# EAGLE design Adafruit PiTFT+ 2.8in (EAGLE 6.6.0)
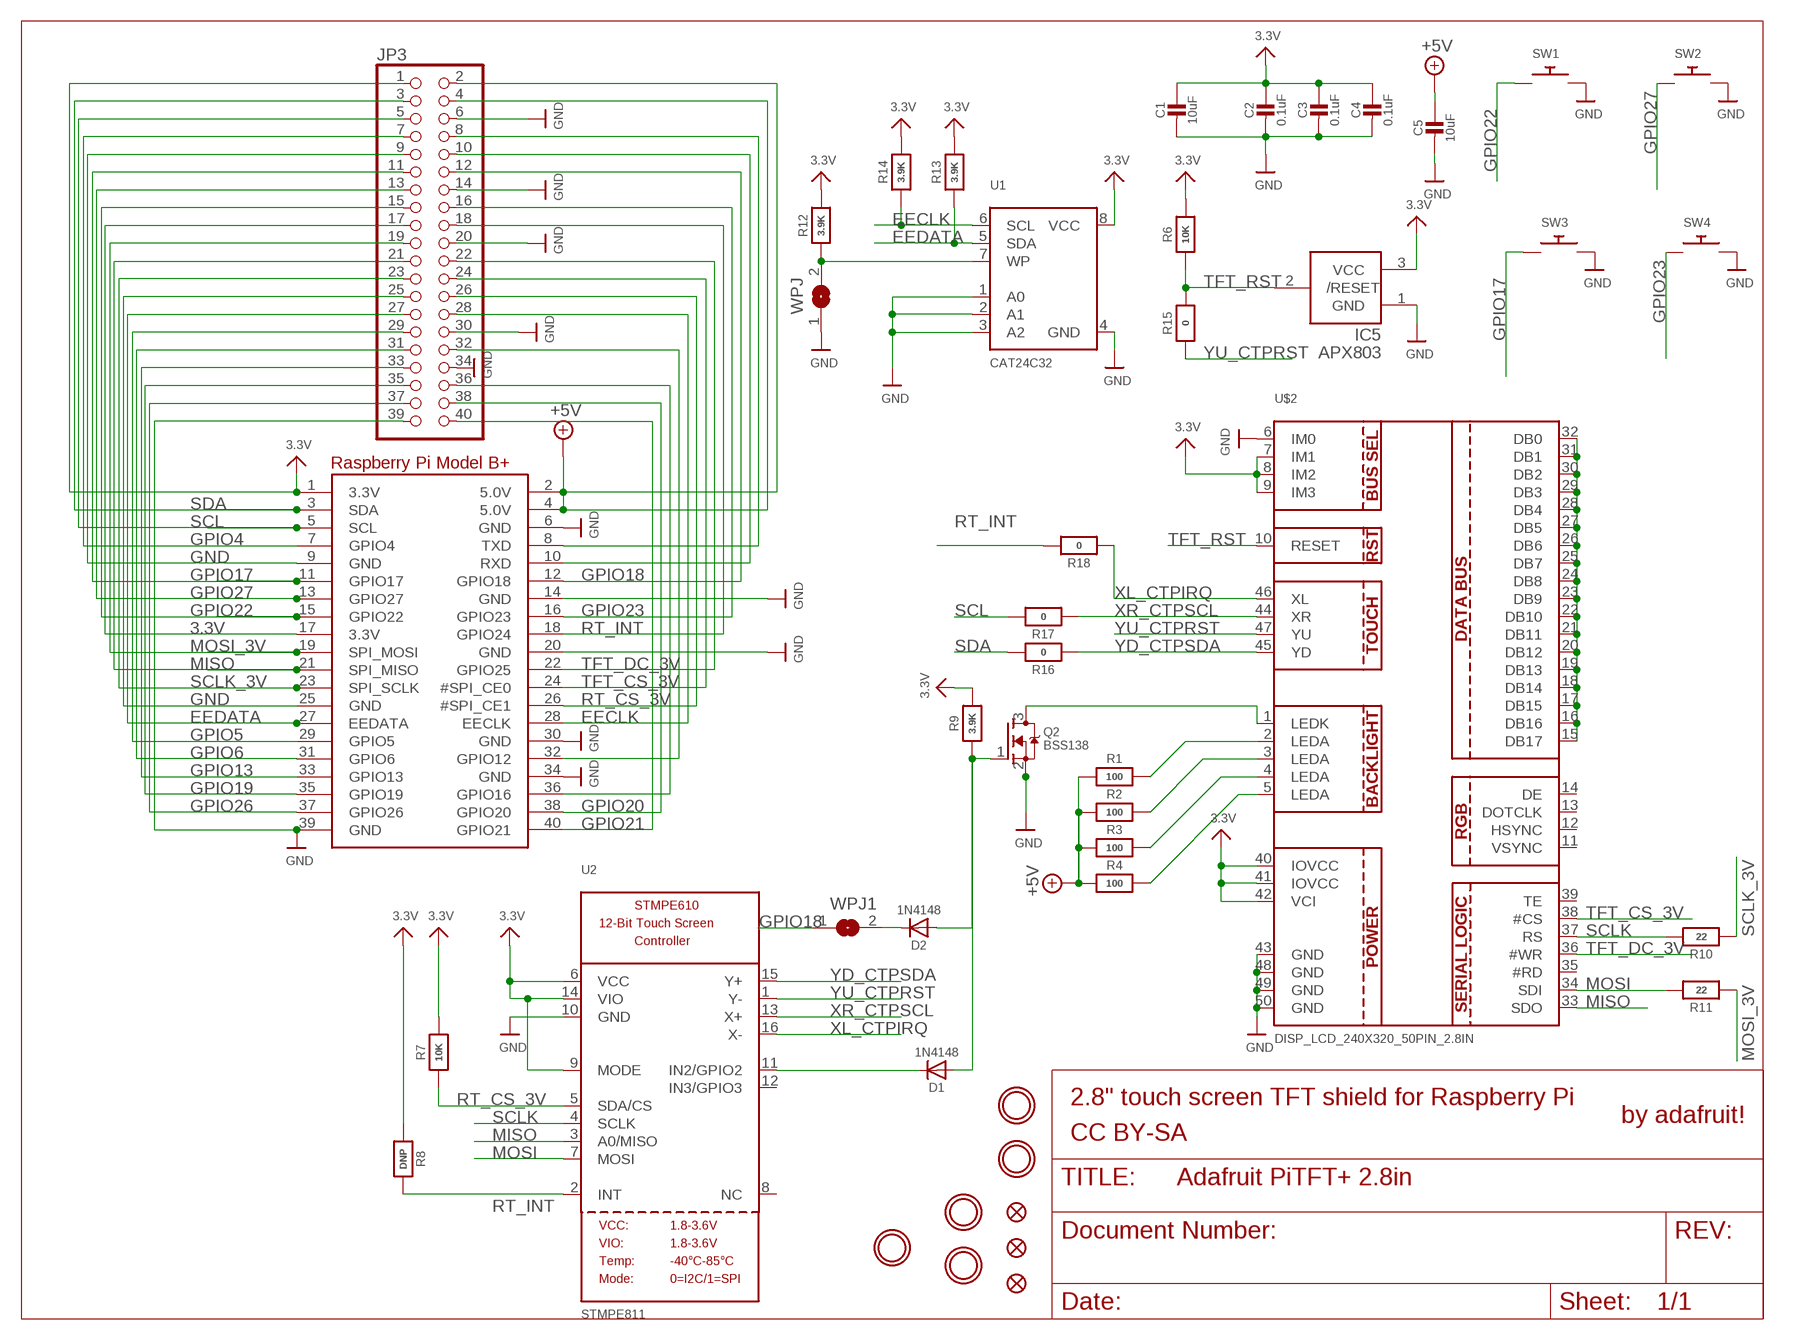
[diagram p0: schematic, sheet 1]

## Parts
C1  10uF  CAP_CERAMIC0805-NOOUTLINE  [0805-NO]
C2  0.1uF  CAP_CERAMIC0805-NOOUTLINE  [0805-NO]
C3  0.1uF  CAP_CERAMIC0805-NOOUTLINE  [0805-NO]
C4  0.1uF  CAP_CERAMIC0805-NOOUTLINE  [0805-NO]
C5  10uF  CAP_CERAMIC0805-NOOUTLINE  [0805-NO]
D1  1N4148  DIODESOD-323  [SOD-323]
D2  1N4148  DIODESOD-323  [SOD-323]
IC5  APX803  AXP083-SAG  [SOT23]
JP3  PINHD-2X20_SMT  [2X20_SMT_MALE]
Q2  BSS138  MOSFET-NWIDE  [SOT23-WIDE]
R1  100  RESISTOR0805_NOOUTLINE  [0805-NO]
R2  100  RESISTOR0805_NOOUTLINE  [0805-NO]
R3  100  RESISTOR0805_NOOUTLINE  [0805-NO]
R4  100  RESISTOR0805_NOOUTLINE  [0805-NO]
R6  10K  RESISTOR0805_NOOUTLINE  [0805-NO]
R7  10K  RESISTOR0805_NOOUTLINE  [0805-NO]
R8  DNP  RESISTOR0805_NOOUTLINE  [0805-NO]
R9  3.9K  RESISTOR0805_NOOUTLINE  [0805-NO]
R10  22  RESISTOR0805_NOOUTLINE  [0805-NO]
R11  22  RESISTOR0805_NOOUTLINE  [0805-NO]
R12  3.9K  RESISTOR0805_NOOUTLINE  [0805-NO]
R13  3.9K  RESISTOR0805_NOOUTLINE  [0805-NO]
R14  3.9K  RESISTOR0805_NOOUTLINE  [0805-NO]
R15  0  RESISTOR0805_NOOUTLINE  [0805-NO]
R16  0  RESISTOR0805_NOOUTLINE  [0805-NO]
R17  0  RESISTOR0805_NOOUTLINE  [0805-NO]
R18  0  RESISTOR0805_NOOUTLINE  [0805-NO]
RPI1  RASPBERRYPI_BPLUS_SHIELD_NODIM  [RASPBERRYPI_BPLUS_SHIELD_NODIM]
SW1  SWITCH_PUSHBUTTONEVQ-PE  [TACT_PANA-EVQ]
SW2  SWITCH_PUSHBUTTONEVQ-PE  [TACT_PANA-EVQ]
SW3  SWITCH_PUSHBUTTONEVQ-PE  [TACT_PANA-EVQ]
SW4  SWITCH_PUSHBUTTONEVQ-PE  [TACT_PANA-EVQ]
U1  CAT24C32  EEPROM_I2C_SOIC8_GENERIC  [SOIC8_150MIL]
U2  STMPE811  STMPE610  [QFN16_3MM]
U$2  DISP_LCD_240X320_50PIN_2.8IN  [TFT_2.83IN_240X320_50PIN]
U$3  MOUNTINGHOLE3.0THIN  [MOUNTINGHOLE_3.0_PLATEDTHIN]
U$10  FIDUCIAL""  [FIDUCIAL_1MM]
U$11  FIDUCIAL""  [FIDUCIAL_1MM]
U$15  MOUNTINGHOLE3.0THIN  [MOUNTINGHOLE_3.0_PLATEDTHIN]
U$16  MOUNTINGHOLE3.0THIN  [MOUNTINGHOLE_3.0_PLATEDTHIN]
U$17  MOUNTINGHOLE3.0THIN  [MOUNTINGHOLE_3.0_PLATEDTHIN]
U$18  FIDUCIAL""  [FIDUCIAL_1MM]
U$40  MOUNTINGHOLE3.0THIN  [MOUNTINGHOLE_3.0_PLATEDTHIN]
WPJ  SOLDERJUMPERCLOSED  [SOLDERJUMPER_CLOSEDWIRE]
WPJ1  SOLDERJUMPERCLOSED  [SOLDERJUMPER_CLOSEDWIRE]

## Nets
3.3V: C1.1 C2.1 C3.1 C4.1 IC5.3(VCC) JP3.1 JP3.17 R6.2 R7.2 R8.1 R9.2 R12.2 R13.2 R14.2 RPI1.1(3.3V) RPI1.17(3.3V) U1.8(VCC) U2.6(VCC) U2.9(MODE) U2.14(VIO) U$2.7(IM1) U$2.8(IM2) U$2.9(IM3) U$2.40(IOVCC) U$2.41(IOVCC) U$2.42(VCI)
+5V: C5.1 JP3.2 JP3.4 R1.1 R2.1 R3.1 R4.1 RPI1.2(5.0V) RPI1.4(5.0V)
EECLK: JP3.28 R14.1 RPI1.28(EECLK) U1.6(SCL)
EEDATA: JP3.27 R13.1 RPI1.27(EEDATA) U1.5(SDA)
GND: C1.2 C2.2 C3.2 C4.2 C5.2 IC5.1(GND) JP3.6 JP3.9 JP3.14 JP3.20 JP3.25 JP3.30 JP3.34 JP3.39 Q2.2(S) RPI1.6(GND) RPI1.9(GND) RPI1.14(GND) RPI1.20(GND) RPI1.25(GND) RPI1.30(GND) RPI1.34(GND) RPI1.39(GND) SW1.P$2 SW2.P$2 SW3.P$2 SW4.P$2 U1.1(A0) U1.2(A1) U1.3(A2) U1.4(GND) U2.10(GND) U$2.6(IM0) U$2.43(GND) U$2.48(GND) U$2.49(GND) U$2.50(GND) WPJ.1
GPIO4: JP3.7 RPI1.7(GPIO4)
GPIO5: JP3.29 RPI1.29(GPIO5)
GPIO6: JP3.31 RPI1.31(GPIO6)
GPIO12: JP3.32 RPI1.32(GPIO12)
GPIO13: JP3.33 RPI1.33(GPIO13)
GPIO16: JP3.36 RPI1.36(GPIO16)
GPIO17: JP3.11 RPI1.11(GPIO17) SW3.P$1
GPIO18: JP3.12 RPI1.12(GPIO18) WPJ1.1
GPIO19: JP3.35 RPI1.35(GPIO19)
GPIO20: JP3.38 RPI1.38(GPIO20)
GPIO21: JP3.40 RPI1.40(GPIO21)
GPIO22: JP3.15 RPI1.15(GPIO22) SW1.P$1
GPIO23: JP3.16 RPI1.16(GPIO23) SW4.P$1
GPIO26: JP3.37 RPI1.37(GPIO26)
GPIO27: JP3.13 RPI1.13(GPIO27) SW2.P$1
MISO: JP3.21 RPI1.21(SPI_MISO) U2.3(A0/MISO) U$2.33(SDO)
MOSI: R11.2 U2.7(MOSI) U$2.34(SDI)
MOSI_3V: JP3.19 R11.1 RPI1.19(SPI_MOSI)
N$1: Q2.3(D) U$2.1(LEDK)
N$2: R1.2 U$2.2(LEDA)
N$3: R2.2 U$2.3(LEDA)
N$4: R3.2 U$2.4(LEDA)
N$5: D1.C U2.11(IN2/GPIO2)
N$6: D2.C WPJ1.2
N$9: U$2.15(DB17) U$2.16(DB16) U$2.17(DB15) U$2.18(DB14) U$2.19(DB13) U$2.20(DB12) U$2.21(DB11) U$2.22(DB10) U$2.23(DB9) U$2.24(DB8) U$2.25(DB7) U$2.26(DB6) U$2.27(DB5) U$2.28(DB4) U$2.29(DB3) U$2.30(DB2) U$2.31(DB1) U$2.32(DB0)
N$10: R4.2 U$2.5(LEDA)
N$12: R12.1 U1.7(WP) WPJ.2
N$16: D1.A D2.A Q2.1(G) R9.1
RT_CS_3V: JP3.26 R7.1 RPI1.26(#SPI_CE1) U2.5(SDA/CS)
RT_INT: JP3.18 R8.2 R18.2 RPI1.18(GPIO24) U2.2(INT)
RXD: JP3.10 RPI1.10(RXD)
SCL: JP3.5 R17.2 RPI1.5(SCL)
SCLK: R10.2 U2.4(SCLK) U$2.37(RS)
SCLK_3V: JP3.23 R10.1 RPI1.23(SPI_SCLK)
SDA: JP3.3 R16.2 RPI1.3(SDA)
TFT_CS_3V: JP3.24 RPI1.24(#SPI_CE0) U$2.38(#CS)
TFT_DC_3V: JP3.22 RPI1.22(GPIO25) U$2.36(#WR)
TFT_RST: IC5.2(/RESET) R6.1 R15.2 U$2.10(RESET)
TXD: JP3.8 RPI1.8(TXD)
XL_CTPIRQ: R18.1 U2.16(X-) U$2.46(XL)
XR_CTPSCL: R17.1 U2.13(X+) U$2.44(XR)
YD_CTPSDA: R16.1 U2.15(Y+) U$2.45(YD)
YU_CTPRST: R15.1 U2.1(Y-) U$2.47(YU)
Unconnected: U2.8(NC) U2.12(IN3/GPIO3) U$2.11(VSYNC) U$2.12(HSYNC) U$2.13(DOTCLK) U$2.14(DE) U$2.35(#RD) U$2.39(TE)

## Notes on the sheet
- 2.8" touch screen TFT shield for Raspberry Pi
- by adafruit!
- CC BY-SA

## Library data of the parts
C1-C5 = microbuilder:CAP_CERAMIC: Ceramic Capacitors For new designs, use the packages preceded by an '_' character since they are more reliable: The following footprints should be used on most boards: _0402 - Standard footprint for regular board layouts _0603 - Standard footprint for regular board layouts _0805 - Standard footprint for regular board layouts _1206 - Standard footprint for regular board layouts For extremely tight-pitch boards where space is at a premium, the following 'micro-pitch' footprints can be used (smaller pads, no silkscreen outline, etc.): _0402MP - Micro-pitch footprint for very dense/compact boards _0603MP - Micro-pitch footprint for very dense/compact boards _0805MP - Micro-pitch footprint for very dense/compact boards _1206MP - Micro-pitch footprint for very dense/compact boards
D1 D2 = microbuilder:DIODE: Diode SMA Model Volts Amps Type Vf Ir Digikey # Notes SSA34-E3 40V 3A Schottky 480mV @ 3A 200uA @ 40V SSA34-E3/61TGITR-ND CDBA120-G 20V 1A Schottky 500mV @ 1A 500uA @ 20V 641-1014-6-ND REEL MBRA210 10V 2A Schottky 350mV @ 2A 700uA @ 10V MBRA210LT3 SOD-123 Model Volts Amps Type Vf Ir Order # Notes BAT54T1G 30V 200mA Schottky 800mV @ 200mA 2uA @ 25V BAT54T1GOSTR-ND B0530W 30V 500mA Schottky 430mV @ 500mA 130uA @ 30V B0530W-FDICT-ND REEL MBR120 20V 1A Schottky 340mV @ 1A MBR120VLSFT1GOSCT-ND SOD-323 Model Volts Amps Type Vf Ir Order # Notes PMEG2005EJ 20V 500mA Schottky 355mV @ 500mA 568-4110-1-ND ZLLS410 10V 570mA Schottky 380mV @ 570mA ZLLS410CT-ND 1N4148WS 75V 150mA Silicon/Simple 1V 1N4148WSFSCT-ND REEL SOD-523 Model Volts Amps Type Vf Ir Order # Notes BAT54XV2 30V 200mA Schottky 0.8V @ 100mA BAT54XV2CT-ND TB751S 30V 30mA Schottky RB751S-40TE61CT-ND SOT23-R/W (R = Solder Paste/Reflow Ovens, W = Hand-Soldering) Model Volts Amps Type Vf Ir Order # Notes BAT54FILM 40V 300mA Schottky 497-7162-1-ND POWERDI-5 Model Volts Amps Type Vf Ir Order # Notes PDS560 60V 5A Schottky 670mV @ 5A 150uA @ 60V PDS560DICT-ND
IC5 = adafruit:AXP083
JP3 = microbuilder:PINHD-2X20: PIN HEADER
Q2 = microbuilder:MOSFET-N: N-Channel Mosfet LEGEND VDS: Voltage Drain-Source ID: Drain Current RDS(ON): Drain-Source On-State Resistance VGS(TH): Gate-Source Threshold Voltage CISS: Drain-Source Input Capacitance SOT-23 Name VDS ID RDS(ON) VGS(TH) CISS Order Number 2N7002E 60V 260mA 2.5 Ohm 2.5V @ 250uA 26.7pF @ 25V 2N7002ET1GOSTR-ND BSH103 30V 850mA 400 mOhm 400mV @ 1mA 83pF @ 24V BSH103,235-ND BSS138 60V 320mA 1.6 Ohm 1.5V @ 250uA 50pF @ 10V Mouser: 771-BSS138PW115 DMN2075U-7 20V 4.2A 38 mOhm 1V @ 250 uA 594.3pF @ 10V DMN2075U-7DICT-ND * BSS138 good choice for I2C level-shifting POWERPAK 1212-8 Name VDS ID RDS(ON) VGS(TH) CISS Order Number Si7308DN 60V 6A 58 mOhm 3V @ 250uA 665pF @ 15V SI7308DN-T1-E3CT-ND
R1-R4 R6-R18 = microbuilder:RESISTOR: Resistors For new designs, use the packages preceded by an '_' character since they are more reliable: The following footprints should be used on most boards: _0402 - Standard footprint for regular board layouts _0603 - Standard footprint for regular board layouts _0805 - Standard footprint for regular board layouts _1206 - Standard footprint for regular board layouts For extremely tight-pitch boards where space is at a premium, the following 'micro-pitch' footprints can be used (smaller pads, no silkscreen outline, etc.): _0402MP - Micro-pitch footprint for very dense/compact boards _0603MP - Micro-pitch footprint for very dense/compact boards _0805MP - Micro-pitch footprint for very dense/compact boards _1206MP - Micro-pitch footprint for very dense/compact boards
RPI1 = microbuilder:RASPBERRYPI_BPLUS
SW1-SW4 = microbuilder:SWITCH_PUSHBUTTON: Buttons SOFTTOUCHSMD_SJ - Soft touch temporary push button (Super Junk Akihabara) Compatible with SKPMANE010 [Mouser: 688-SKPMAN] C&K_KSS = Digikey: KSS221GLFS
U1 = microbuilder:EEPROM_I2C_SOIC8_GENERIC: Note: The same pinout is used for many I2C EEPROMs in SOIC8(150mil) from a variety of manufacturers and in various sizes. Examples: 16K (2K x 8 Bit) I2C EEPROM 1.7-5.5V, 400KHz, -40°C-85°C Digikey: CAT24C16WI-GT3CT-ND 256K (32K x 8 Bit) I2C EEPROM 1.7-5.5V, 400KHz, -40°C-85°C Digikey: 24AA256-I/SN-ND
U2 = microbuilder:STMPE610: STMPE610 - 12-Bit Touch Screen Controller
U$2 = microbuilder:DISP_LCD_240X320_50PIN
U$3 U$15-U$17 U$40 = microbuilder:MOUNTINGHOLE: Mounting Hole For #2 screws (0.086"/2.18mm width, 0.094"/2.4mm hole) use 2.5mm; BOM: EXCLUDE
U$10 U$11 U$18 = microbuilder:FIDUCIAL: Fiducial Alignment Points Various fiducial points for machine vision alignment.; BOM: EXCLUDE
WPJ WPJ1 = microbuilder:SOLDERJUMPER: SMD Solder JUMPER Solder the two pads together to create a connection, or remove the solder to break it. REFLOW - Use this footprint for solder paste and reflow ovens. WAVE - Use this footprint for hand-soldering (larger pads). CLOSED - Has a trace between the two pads to ensure it is closed by default. The trace needs to be cut to disable the jumper, and can be closed again by creating a solder bridge between the two pads.

## Board
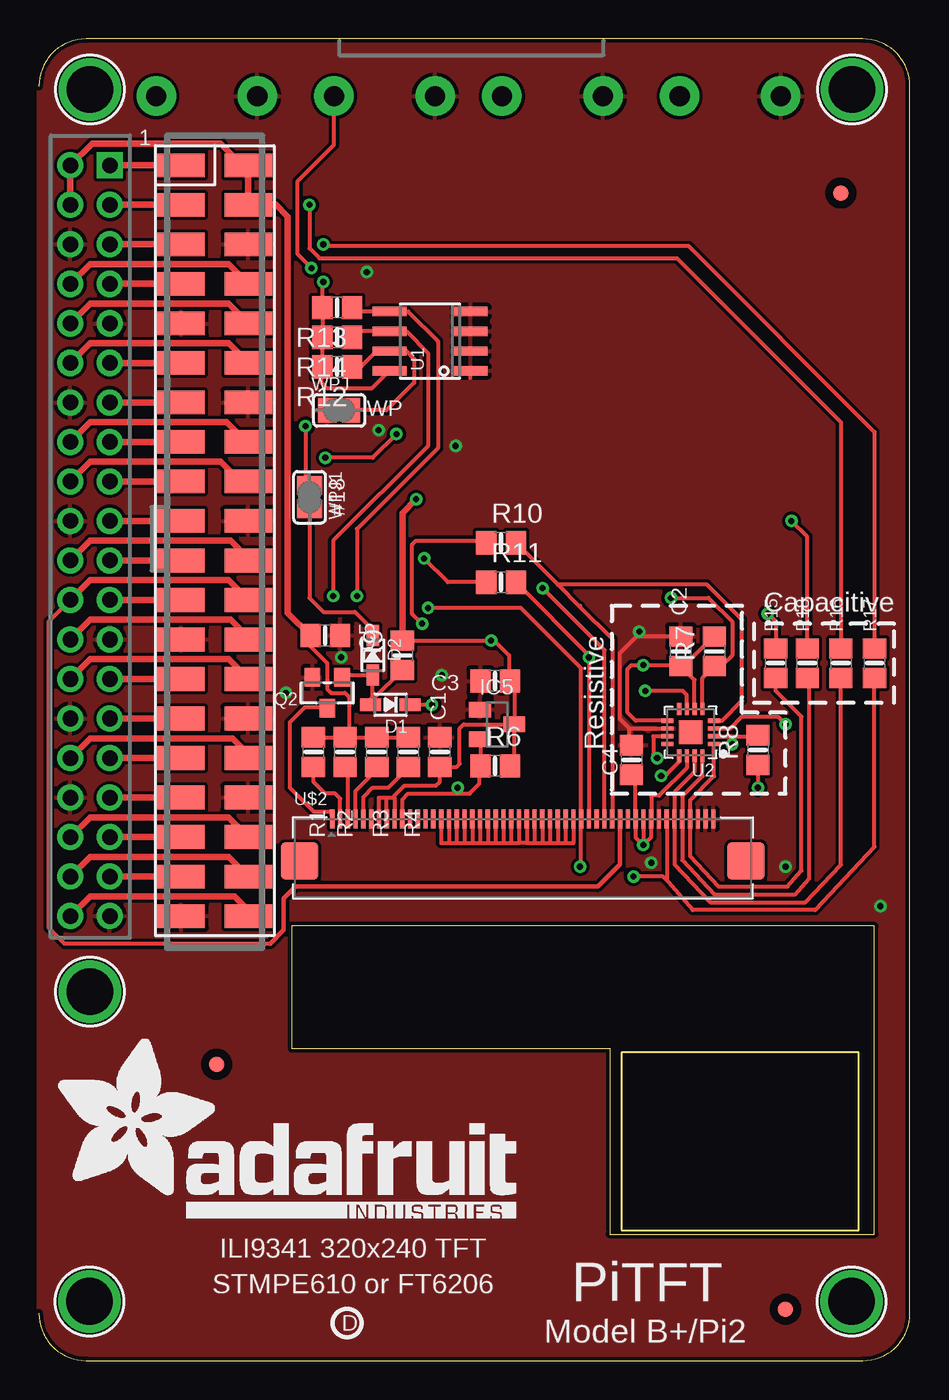
[diagram p1: board, top side]
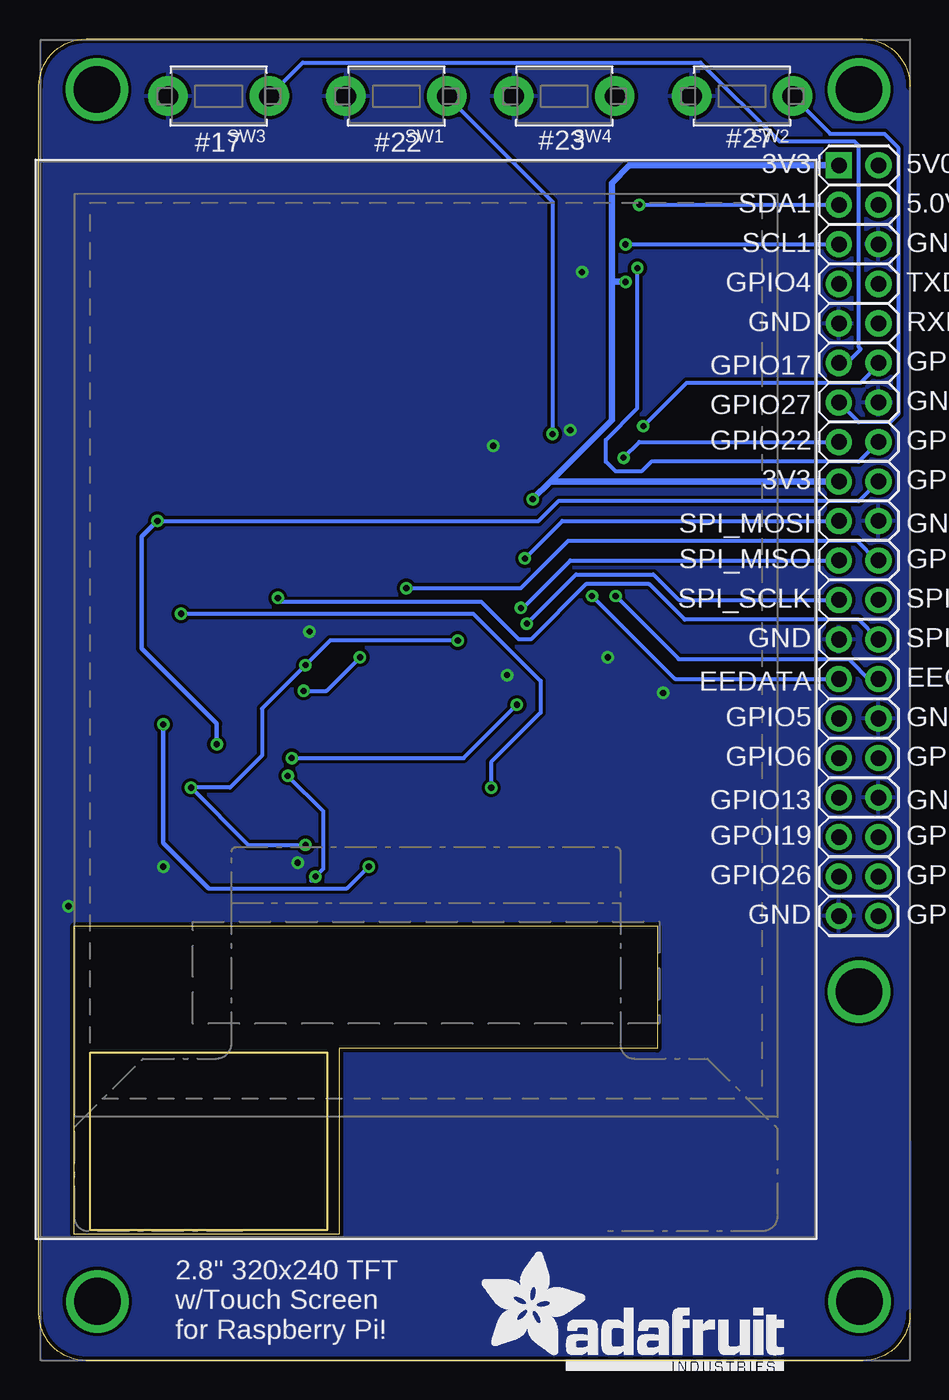
[diagram p2: board, bottom side, seen from below]

Size 56.01 x 84.96 mm. Coordinates in mm from the lower left corner, seen from the top.
Outline: 0,3.05 arc90 3.05,0 52.96,0 arc90 56.01,3.05 56.01,81.92 arc90 52.96,84.96 3.05,84.96 arc90 0,81.92
Outline: 53.72,27.94 16.26,27.94 16.26,20.07 36.7,20.07 36.7,8.13 53.72,8.13 53.72,27.94
Copper layers (1*16): Top 0.035mm / dielectric 1.5mm / Bottom 0.035mm
Design rules "adafruit": minimum track width 8mil, minimum drill 15.5mil, track to track 8mil, track to pad 8mil, pad to pad 8mil, via to via 8mil, smd to smd 8mil, copper to edge 10mil, drill to drill 8mil, minimum pad ring 10mil, minimum via ring 8mil, stop-mask expansion 2mil, vias tented up to drill 20mil, thermal gap 10mil

### Footprints (pad centres in the part's own frame; a part is rotated, then mirrored left to right if it is on the bottom)
0805-NO = smd 1.3 x 1.5: 1 -0.95,0; 2 0.95,0
SOD-323 = smd 1.35 x 0.8: A 1.27,0; C -1.27,0
SOT23 = smd 1 x 1.4: 1 -0.95,-1.1; 2 0.95,-1.1; 3 0,1.1
2X20_SMT_MALE = smd 1.524 x 3.048: 1 -24.13,-2.159; 2 -24.13,2.159; 3 -21.59,-2.159; 4 -21.59,2.159; 5 -19.05,-2.159; 6 -19.05,2.159; 7 -16.51,-2.159; 8 -16.51,2.159; 9 -13.97,-2.159; 10 -13.97,2.159; 11 -11.43,-2.159; 12 -11.43,2.159; 13 -8.89,-2.159; 14 -8.89,2.159; 15 -6.35,-2.159; 16 -6.35,2.159; 17 -3.81,-2.159; 18 -3.81,2.159; 19 -1.27,-2.159; 20 -1.27,2.159; 21 1.27,-2.159; 22 1.27,2.159; 23 3.81,-2.159; 24 3.81,2.159; 25 6.35,-2.159; 26 6.35,2.159; 27 8.89,-2.159; 28 8.89,2.159; 29 11.43,-2.159; 30 11.43,2.159; 31 13.97,-2.159; 32 13.97,2.159; 33 16.51,-2.159; 34 16.51,2.159; 35 19.05,-2.159; 36 19.05,2.159; 37 21.59,-2.159; 38 21.59,2.159; 39 24.13,-2.159; 40 24.13,2.159
SOT23-WIDE = smd 1 x 1.2: 1 -0.95,-1; 2 0.95,-1; 3 0,1
RASPBERRYPI_BPLUS_SHIELD_NODIM = drill 1 pad 1.676 square: 1 51.315,76.835 | drill 1 pad 1.676: 2 53.855,76.835; 3 51.315,74.295; 4 53.855,74.295; 5 51.315,71.755; 6 53.855,71.755; 7 51.315,69.215; 8 53.855,69.215; 9 51.315,66.675; 10 53.855,66.675; 11 51.315,64.135; 12 53.855,64.135; 13 51.315,61.595; 14 53.855,61.595; 15 51.315,59.055; 16 53.855,59.055; 17 51.315,56.515; 18 53.855,56.515; 19 51.315,53.975; 20 53.855,53.975; 21 51.315,51.435; 22 53.855,51.435; 23 51.315,48.895; 24 53.855,48.895; 25 51.315,46.355; 26 53.855,46.355; 27 51.315,43.815; 28 53.855,43.815; 29 51.315,41.275; 30 53.855,41.275; 31 51.315,38.735; 32 53.855,38.735; 33 51.315,36.195; 34 53.855,36.195; 35 51.315,33.655; 36 53.855,33.655; 37 51.315,31.115; 38 53.855,31.115; 39 51.315,28.575; 40 53.855,28.575
TACT_PANA-EVQ = drill 1.3 pad 2.54: P$1 -3.25,0; P$2 3.25,0
SOIC8_150MIL = smd 0.6 x 2.2: 1 -1.905,-2.6; 2 -0.635,-2.6; 3 0.635,-2.6; 4 1.905,-2.6; 5 1.905,2.6; 6 0.635,2.6; 7 -0.635,2.6; 8 -1.905,2.6
QFN16_3MM = smd 0.8 x 0.28: 1 -1.5,0.75; 2 -1.5,0.25; 3 -1.5,-0.25; 4 -1.5,-0.75; 9 1.5,-0.75; 10 1.5,-0.25; 11 1.5,0.25; 12 1.5,0.75 | smd 0.28 x 0.8: 5 -0.75,-1.5; 6 -0.25,-1.5; 7 0.25,-1.5; 8 0.75,-1.5; 13 0.75,1.5; 14 0.25,1.5; 15 -0.25,1.5; 16 -0.75,1.5 | smd 1.5 x 1.5: THERMAL 0,0
TFT_2.83IN_240X320_50PIN = smd 0.275 x 1.2 bottom: 1 12.25,-10.39; 2 11.75,-10.39; 3 11.25,-10.39; 4 10.75,-10.39; 5 10.25,-10.39; 6 9.75,-10.39; 7 9.25,-10.39; 8 8.75,-10.39; 9 8.25,-10.39; 10 7.75,-10.39; 11 7.25,-10.39; 12 6.75,-10.39; 13 6.25,-10.39; 14 5.75,-10.39; 15 5.25,-10.39; 16 4.75,-10.39; 17 4.25,-10.39; 18 3.75,-10.39; 19 3.25,-10.39; 20 2.75,-10.39; 21 2.25,-10.39; 22 1.75,-10.39; 23 1.25,-10.39; 24 0.75,-10.39; 25 0.25,-10.39; 26 -0.25,-10.39; 27 -0.75,-10.39; 28 -1.25,-10.39; 29 -1.75,-10.39; 30 -2.25,-10.39; 31 -2.75,-10.39; 32 -3.25,-10.39; 33 -3.75,-10.39; 34 -4.25,-10.39; 35 -4.75,-10.39; 36 -5.25,-10.39; 37 -5.75,-10.39; 38 -6.25,-10.39; 39 -6.75,-10.39; 40 -7.25,-10.39; 41 -7.75,-10.39; 42 -8.25,-10.39; 43 -8.75,-10.39; 44 -9.25,-10.39; 45 -9.75,-10.39; 46 -10.25,-10.39; 47 -10.75,-10.39; 48 -11.25,-10.39; 49 -11.75,-10.39; 50 -12.25,-10.39 | smd 2.4 x 2.4 bottom: PAD1 14.35,-13.09; PAD2 -14.35,-13.09
MOUNTINGHOLE_3.0_PLATEDTHIN = drill 3 pad 3.6: P$1 0,0
FIDUCIAL_1MM = smd 1 x 1: 1 0,0
SOLDERJUMPER_CLOSEDWIRE = smd 1.168 x 1.6: 1 -0.762,0; 2 0.762,0 | smd 0.635 x 0.203: WIRE 0,0

### Placement (x,y rotation side)
C1  25.78,39.12 90 top
C2  41.27,45.59 90 top
C3  29.34,43.69 180 top
C4  38.1,38.61 90 top
C5  18.41,46.61 0 top
D1  22.61,42.16 180 top
D2  21.46,45.34 270 top
IC5  29.46,40.89 270 top
JP3  11.3,52.7 270 top
Q2  18.54,42.93 180 top
R1  17.65,39.12 270 top
R2  19.68,39.12 270 top
R3  21.72,39.12 270 top
R4  23.75,39.12 270 top
R6  29.34,38.23 0 top
R7  43.43,45.59 90 top
R8  46.23,39.24 90 top
R9  23.37,45.34 90 top
R10  29.72,52.58 0 top
R11  29.72,50.04 0 top
R12  19.18,63.88 180 top
R13  19.18,67.69 180 top
R14  19.18,65.79 180 top
R15  47.37,44.83 90 top
R16  51.56,44.83 90 top
R17  53.72,44.83 90 top
R18  49.4,44.83 90 top
RPI1  55.88,0 0 bottom
SW1  33.02,81.28 180 bottom
SW2  10.79,81.28 180 bottom
SW3  44.45,81.28 180 bottom
SW4  22.23,81.28 180 bottom
U1  25.15,65.53 90 top
U2  41.91,40.39 180 top
U$2  31.11,45.21 0 bottom
U$3  3.28,81.71 0 top
U$10  48.01,3.3 90 top
U$11  11.43,19.05 180 top
U$12  [PCBFEAT-REV-040]  19.81,2.41 0 top
U$15  52.27,81.71 0 top
U$16  52.25,3.81 0 top
U$17  3.25,3.81 0 top
U$18  51.56,75.06 0 top
U$23  [ADAFRUIT_TEXT_20MM]  27.69,-0.64 0 bottom
U$40  3.28,23.72 0 top
U$42  [ADAFRUIT_TEXT_30MM]  1.02,9.14 0 top
WPJ  19.3,61.09 0 top
WPJ1  17.4,55.5 270 top

### Tracks (layer width: path | path; a pad name or v marks a point on that pad's centre or on a via)
3.3V  (via drill 0.39)
  Top 0.254: U$2.7 21.86,36.2 22.36,36.2 | 22.36,36.2 22.86,36.2 | 22.86,36.2 22.86,35.19 U$2.9 | U$2.8 22.36,36.2 | 22.86,36.2 22.86,36.32 23.5,36.96 25.53,36.96 25.78,37.21 C1.1 26.86,38.17 27.05,38.35 27.05,40.64 27.3,40.89 IC5.3 | R6.2 30.56,38.5 IC5.3 | IC5.3 30.56,43.41 C3.1 30.23,43.75 30.23,45.34 29.28,46.29 v29.07,46.29 R9.2 | U$2.41 v38.87,33.15 v38.86,33.15 | C4.1 38.37,37.66 U$2.40 38.37,33.64 v38.86,33.15 | U1.8 21.4,62.48 18.54,62.48 18.16,62.87 18.16,63.81 R12.2 R14.2 R13.2 18.23,69.28 v18.29,69.34 | U2.6 42.16,43.76 C2.1 | U2.9 38.37,41.14 37.85,41.66 37.85,44.45 38.1,44.7 v38.86,44.7 41.21,44.7 C2.1 | R7.2 43.43,46.61 41.91,45.09 41.72,45.09 C2.1 | R8.1 v46.23,36.83 | U2.14 41.66,38.1 39.88,36.32 39.37,36.32 39.37,35.19 U$2.42 39.37,33.65 v38.86,33.15
  Top 0.406: JP3.1 RPI1.1 | RPI1.17 JP3.17 | v24.26,55.37 23.37,54.48 R9.2
  Bottom 0.254: v29.07,46.29 37.28,46.29 v38.86,44.7 41.66,41.91 U2.14 43.72,36.83 v46.23,36.83 42.55,33.15 v38.86,33.15
  Bottom 0.406: v18.29,69.34 19.18,69.34 | 19.18,69.34 19.18,75.69 18.03,76.83 RPI1.1 | RPI1.17 23.11,56.52 | 23.11,56.52 v24.26,55.37 | 23.11,56.52 19.18,60.45 19.18,69.34
+5V
  Top 0.254: R1.1 R2.1 | R2.1 R3.1 R4.1 | C5.1 17.46,45.91 18.54,44.83 18.54,43.18 18.8,42.93 19.68,42.93 19.94,42.67 19.94,40.32 R2.1
  Top 0.406: RPI1.4 RPI1.2 3.42,78.23 11.68,78.23 13.08,76.83 JP3.2 JP3.4 15.24,74.3 16,73.53 16,48.07 C5.1
EECLK  (via drill 0.39)
  Top 0.254: R14.1 20.51,66.17 U1.6 23.62,66.17 25.02,64.77 25.02,58.8 18.92,52.7 v18.92,49.15
  Top 0.406: RPI1.28 3.29,45.09 12.19,45.09 JP3.28
  Bottom 0.254: v18.92,49.15 14.86,45.09 3.94,45.09 2.54,43.69 2.41,43.81 RPI1.28
EEDATA  (via drill 0.39)
  Top 0.254: R13.1 20.38,67.44 U1.5 23.75,67.44 25.65,65.53 25.65,58.67 20.45,53.47 v20.45,49.15
  Top 0.406: JP3.27 RPI1.27
  Bottom 0.254: v20.45,49.15 15.11,43.81 RPI1.27
GND  (via drill 0.39)
  Top 0.254: 27.75,63.18 U1.1 | C2.2 38.41,46.54 37.34,45.47 37.34,41.27 37.97,40.64 | 37.97,40.64 U2.10 | C4.2 37.97,39.56 37.97,40.64
  Bottom 0.305: 26.54,58.93 26.8,58.67 | v26.8,58.8 26.8,58.67 | 26.8,58.67 26.86,58.61
  other vias: 38.61,46.86 15.88,42.93 25.91,44.07 19.43,45.21 54.1,29.21 48.01,31.75 21.08,69.98 21.84,59.82 39.37,32
  pour Top: 55.88,0 0,0 0,84.96 55.88,84.96
  pour Bottom: 55.88,0 0,0 0.13,84.84 56.01,84.84
GPIO4
  Top 0.406: RPI1.7 JP3.7
GPIO5
  Top 0.406: RPI1.29 JP3.29
GPIO6
  Top 0.406: RPI1.31 JP3.31
GPIO12
  Top 0.406: RPI1.32 3.29,40.01 12.45,40.01 13.46,38.99 JP3.32
GPIO13
  Top 0.406: JP3.33 RPI1.33
GPIO16
  Top 0.406: RPI1.36 3.29,34.92 12.19,34.92 JP3.36
GPIO17
  Top 0.406: RPI1.11 JP3.11
  Bottom 0.254: SW3.P$1 39.04,83.44 13.46,83.44 8.38,78.36 3.56,78.36 3.3,78.11 3.3,65.15 3.17,65.02 4.06,64.14 RPI1.11
GPIO18  (via drill 0.39)
  Top 0.254: v17.14,60.07 17.14,56.52 WPJ1.1
  Top 0.406: RPI1.12 3.29,65.41 12.19,65.41 JP3.12
  Bottom 0.254: v17.14,60.07 14.35,62.87 3.17,62.87 2.02,64.02 RPI1.12
GPIO19
  Top 0.406: RPI1.35 JP3.35
GPIO20
  Top 0.406: JP3.38 12.19,32.38 3.29,32.38 RPI1.38
GPIO21
  Top 0.406: RPI1.40 3.29,29.84 12.57,29.84 13.46,28.96 JP3.40
GPIO22  (via drill 0.39)
  Top 0.254: v22.99,59.56 21.46,58.04 v18.41,58.04
  Top 0.406: RPI1.15 JP3.15
  Bottom 0.254: SW1.P$1 22.99,74.5 v22.99,59.56 | v18.41,58.04 17.4,59.05 RPI1.15
GPIO23  (via drill 0.39)
  Top 0.254: v17.53,70.23 16.64,71.12 16.64,75.82 18.98,78.16 SW4.P$1
  Top 0.406: RPI1.16 3.29,60.33 12.06,60.33 13.34,59.05 JP3.16
  Bottom 0.254: RPI1.16 3.29,57.78 16.64,57.78 17.27,57.15 18.92,57.15 19.56,57.78 19.56,59.18 17.53,61.21 v17.53,70.23
GPIO26
  Top 0.406: JP3.37 RPI1.37
GPIO27
  Top 0.406: RPI1.13 JP3.13
  Bottom 0.254: SW2.P$1 5.13,78.87 1.65,78.87 0.76,77.98 0.76,60.83 1.27,60.33 3.29,60.33 RPI1.13
MISO  (via drill 0.39)
  Top 0.254: v25.02,48.39 30.99,48.39 34.87,44.51 U$2.33 34.87,31.82 v34.8,31.75 | U2.3 44.45,40.64 45.21,41.4 47.5,41.4 v48.01,40.89
  Top 0.406: RPI1.21 JP3.21
  Bottom 0.254: RPI1.21 21.84,51.44 24.89,48.39 v25.02,48.39 | 45.09,30.35 36.2,30.35 v34.8,31.75
  Bottom 0.305: 45.09,30.35 48.01,33.27 v48.01,40.89
MOSI  (via drill 0.39)
  Top 0.254: R11.2 35.37,45.34 v35.37,45.21 U$2.34 | U2.7 41.66,42.8 41.4,43.05 v38.99,43.05
  Bottom 0.254: v38.99,43.05 37.52,43.05 v35.37,45.21
MOSI_3V  (via drill 0.39)
  Top 0.254: R11.1 26.29,50.04 v24.77,51.56
  Top 0.406: RPI1.19 JP3.19
  Bottom 0.254: v24.77,51.56 22.35,53.98 RPI1.19
N$1
  Top 0.254: U$2.1 18.74,35.31 17.65,35.31 16.13,36.83 16.13,41.02 17.08,41.97 18.49,41.97 Q2.3
N$2
  Top 0.254: U$2.2 19.36,36.13 19.05,36.45 18.41,36.45 17.65,37.21 R1.2
N$3
  Top 0.254: U$2.3 19.86,37.99 R2.2
N$4
  Top 0.254: U$2.4 20.36,36.62 21.72,37.97 R3.2
N$5  (via drill 0.39)
  Top 0.254: U2.11 39.5,40.14 39.5,38.99 v39.75,38.73 | D1.C v25.27,42.16
  Bottom 0.254: v39.75,38.73 28.7,38.73 v25.27,42.16
N$6
  Top 0.254: WPJ1.2 17.4,49.02 18.29,48.13 20.32,48.13 21.46,46.99 D2.C
N$9
  Top 0.254: U$2.15 25.86,33.27 26.36,33.27 | 26.36,33.27 26.86,33.27 | 26.86,33.27 27.36,33.27 | 27.36,33.27 27.86,33.27 | 27.86,33.27 28.36,33.27 | 28.36,33.27 28.86,33.27 | 28.86,33.27 29.36,33.27 | 29.36,33.27 29.86,33.27 | 29.86,33.27 30.36,33.27 | 30.36,33.27 30.86,33.27 | 31.36,33.27 31.86,33.27 | 31.86,33.27 32.37,33.27 | 32.37,33.27 32.87,33.27 | 32.87,33.27 33.37,33.27 | 33.37,33.27 33.87,33.27 | 33.87,33.27 34.37,33.27 U$2.32 | U$2.31 33.87,33.27 | U$2.30 33.37,33.27 | U$2.29 32.87,33.27 | U$2.28 32.37,33.27 | U$2.27 31.86,33.27 | U$2.26 31.36,33.27 | 31.36,33.27 30.86,33.27 | U$2.25 30.86,33.27 | U$2.24 30.36,33.27 | U$2.23 29.86,33.27 | U$2.22 29.36,33.27 | U$2.21 28.86,33.27 | U$2.20 28.36,33.27 | U$2.19 27.86,33.27 | U$2.18 27.36,33.27 | U$2.17 26.86,33.27 | U$2.16 26.36,33.27
N$10
  Top 0.254: U$2.5 20.86,36.23 21.46,36.83 22.48,36.83 23.75,38.1 R4.2
N$12
  Top 0.254: R12.1 20.7,63.88 21.72,64.9 U1.7 23.62,64.9 24.13,64.39 24.13,62.87 22.35,61.09 WPJ.2
N$16
  Top 0.254: R9.1 21.53,42.55 21.34,42.55 D1.A 21.46,42.16 D2.A 19.64,44.07 Q2.1
RT_CS_3V  (via drill 0.39)
  Top 0.254: U2.5 42.66,43.87 R7.1 43.88,44.64 44.58,45.34 44.58,47.5 43.05,49.02 v40.64,49.02
  Top 0.406: RPI1.26 3.29,47.62 12.32,47.62 13.46,46.48 JP3.26
  Bottom 0.254: RPI1.26 3.29,47.62 14.48,47.62 16.76,49.91 20.83,49.91 24.38,46.35 25.15,46.35 27.56,48.77 40.39,48.77 v40.64,49.02
RT_INT  (via drill 0.39)
  Top 0.254: U2.2 44.44,40.14 46.23,40.14 R8.2 | R18.2 49.4,52.96 v48.39,53.98
  Top 0.305: 44.44,40.14 44.58,40.14 v44.58,39.62
  Top 0.406: RPI1.18 3.29,57.78 11.68,57.78 12.95,56.52 JP3.18
  Bottom 0.254: RPI1.18 3.29,55.24 22.61,55.24 23.88,53.98 v48.39,53.98
  Bottom 0.305: v44.58,39.62 44.58,40.95 R18.2 49.4,52.96 v48.39,53.98
RXD
  Top 0.406: RPI1.10 3.29,67.94 12.19,67.94 JP3.10
SCL  (via drill 0.39)
  Top 0.254: v18.29,71.75 18.41,71.63 41.78,71.63 53.72,59.69 R17.2
  Top 0.406: RPI1.5 JP3.5
  Bottom 0.254: v18.29,71.75 RPI1.5
SCLK
  Top 0.254: R10.2 33.37,49.88 | 33.37,49.88 34.77,48.48 | 34.77,48.48 36.87,46.38 U$2.37 | U2.4 43.93,41.14 45.21,42.42 45.21,47.62 42.96,49.88 33.37,49.88 | 34.8,48.51 34.77,48.48
SCLK_3V  (via drill 0.39)
  Top 0.254: v24.64,47.37 24,48.01 24,52.45 24.26,52.7 28.64,52.7 R10.1
  Top 0.406: JP3.23 RPI1.23
  Bottom 0.254: RPI1.23 14.86,48.9 16.51,50.55 21.46,50.55 v24.64,47.37
SDA  (via drill 0.39)
  Top 0.254: v17.4,74.3 17.53,74.17 17.4,74.04 17.4,71.5 18.03,70.87 41.02,70.87 51.56,60.33 R16.2
  Top 0.406: RPI1.3 JP3.3
  Bottom 0.254: v17.4,74.3 RPI1.3
TFT_CS_3V
  Top 0.254: 14.86,26.8 1.65,26.8 0.64,27.81 0.64,47.51 RPI1.24
  Top 0.305: U$2.38 37.37,31.9 35.94,30.48 16.51,30.48 15.75,29.72 15.75,27.69 14.86,26.8
  Top 0.406: RPI1.24 3.29,50.16 12.19,50.16 JP3.24
TFT_DC_3V  (via drill 0.39)
  Top 0.254: U$2.36 36.37,45.68 v32.38,49.66
  Top 0.406: RPI1.22 3.29,52.7 12.32,52.7 13.46,51.56 JP3.22
  Bottom 0.254: v32.38,49.66 25.02,49.66 21.97,52.7 3.43,52.7 2.16,51.44 RPI1.22
TFT_RST  (via drill 0.39)
  Top 0.254: U$2.10 23.36,36.06 23.75,36.45 26.92,36.45 | 26.92,36.45 27.69,36.45 28.32,37.08 28.32,38.16 R6.1 28.39,39.92 IC5.2 | 26.92,36.45 v26.92,36.83 | v46.86,48.01 47.37,47.5 R15.2
  Bottom 0.254: v46.86,48.01 28.07,48.01 23.75,43.69 23.75,41.66 26.92,38.48 v26.92,36.83
TXD
  Top 0.406: RPI1.8 3.29,70.48 12.19,70.48 JP3.8
XL_CTPIRQ
  Top 0.254: U2.16 42.66,37.58 41.37,36.28 U$2.46 41.37,32.17 43.43,29.97 48.64,29.97 49.53,30.99 49.53,43.75 R18.1
XR_CTPSCL  (via drill 0.39)
  Top 0.254: U2.13 41.16,38.49 40.36,37.69 40.1,37.69 v40.01,37.59 | 40.37,30.88 40.13,31.11 v38.23,31.11 | R17.1 53.72,33.02 49.91,28.96 42.04,28.96 40.51,30.73 40.37,30.88 | U$2.44 40.37,30.88
  Bottom 0.254: 38.48,30.86 v38.23,31.11 37.72,31.62 37.72,35.31 v40.01,37.59
YD_CTPSDA
  Top 0.254: U2.15 42.16,37.84 40.87,36.55 U$2.45 40.87,31.91 43.18,29.46 49.28,29.46 51.56,31.88 R16.1
YU_CTPRST
  Top 0.254: U2.1 43.41,37.57 41.87,36.02 U$2.47 41.87,32.43 43.69,30.48 48.13,30.48 49.02,31.5 49.02,41.4 47.37,43.05 R15.1

### Text on the board
tPlace: 1 | WP | #18 | Capacitive | Resistive | ILI9341 320x240 TFT | STMPE610 or FT6206 | PiTFT | Model B+/Pi2
bPlace: #27 | #23 | #22 | #17 | 2.8" 320x240 TFT / w/Touch Screen / for Raspberry Pi!